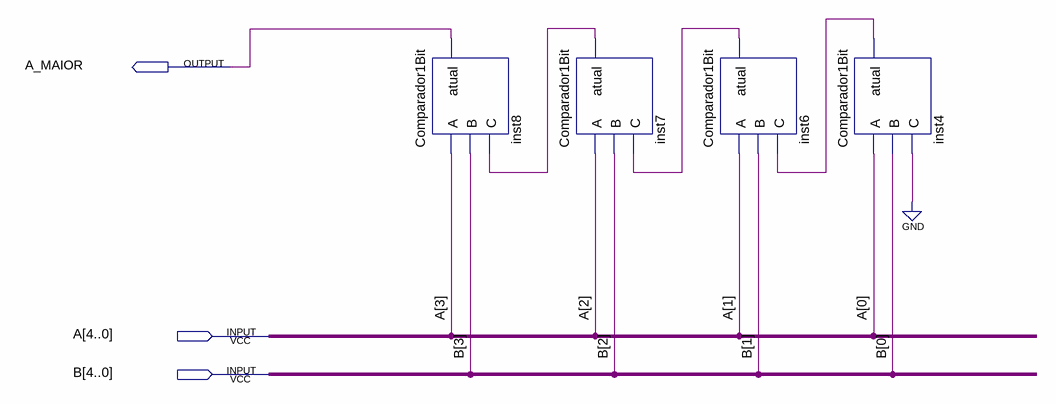
[diagram p0: schematic sheet]
// Quartus schematic CompararMagnitude.bdf as structural Verilog: 4 symbols, 3 pins
module CompararMagnitude (
  input  [4:0] A,
  input  [4:0] B,
  output A_MAIOR
);

  wire inst4_atual, inst6_atual, inst7_atual;

  Comparador1Bit inst8 (.A(A[3]), .B(B[3]), .C(inst7_atual), .atual(A_MAIOR));
  Comparador1Bit inst7 (.A(A[2]), .B(B[2]), .C(inst6_atual), .atual(inst7_atual));
  Comparador1Bit inst6 (.A(A[1]), .B(B[1]), .C(inst4_atual), .atual(inst6_atual));
  Comparador1Bit inst4 (.A(A[0]), .B(B[0]), .C(1'b0), .atual(inst4_atual));
endmodule
